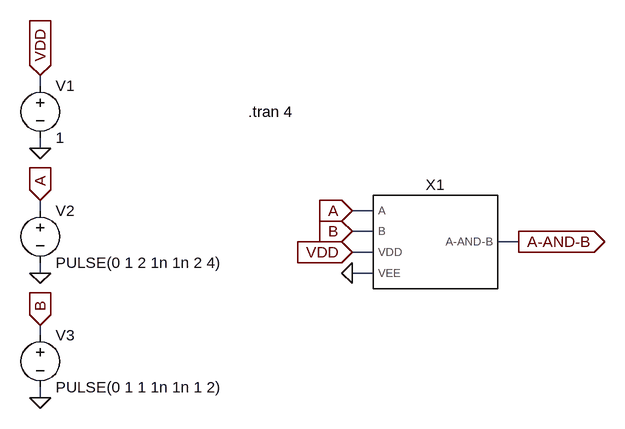
[diagram p0: schematic 2_Input_AND_Gate_Symbol_Test.asc]
2_Input_AND_Gate_Symbol_Test.asc, the LTspice schematic file:
Version 4
SHEET 1 908 680
WIRE 32 112 32 96
WIRE 32 208 32 192
WIRE 32 304 32 288
WIRE 544 304 512 304
WIRE 544 336 512 336
WIRE 768 352 736 352
WIRE 544 368 512 368
WIRE 32 400 32 384
WIRE 544 400 512 400
WIRE 32 496 32 480
WIRE 32 592 32 576
FLAG 32 592 0
FLAG 32 400 0
FLAG 32 208 0
FLAG 512 400 0
FLAG 32 96 VDD
IOPIN 32 96 In
FLAG 512 368 VDD
IOPIN 512 368 In
FLAG 32 288 A
IOPIN 32 288 In
FLAG 512 304 A
IOPIN 512 304 In
FLAG 32 480 B
IOPIN 32 480 In
FLAG 512 336 B
IOPIN 512 336 In
FLAG 768 352 A-AND-B
IOPIN 768 352 Out
SYMBOL 2_Input_AND_Gate_Symbol 640 352 R0
SYMATTR InstName X1
SYMBOL Voltage 32 96 R0
SYMATTR InstName V1
SYMATTR Value 1
SYMBOL Voltage 32 288 R0
SYMATTR InstName V2
SYMATTR Value PULSE(0 1 2 1n 1n 2 4)
SYMBOL Voltage 32 480 R0
SYMATTR InstName V3
SYMATTR Value PULSE(0 1 1 1n 1n 1 2)
TEXT 352 152 Left 2 !.tran 4

The netlist it stands for:
* 2_Input_AND_Gate_Symbol_Test.asc
XX1 A B VDD 0 A-AND-B 2_Input_AND_Gate_Symbol  ; pins A B VDD VEE A-AND-B
V1 VDD 0 1
V2 A 0 PULSE(0 1 2 1n 1n 2 4)
V3 B 0 PULSE(0 1 1 1n 1n 1 2)
.tran 4
.backanno
.end